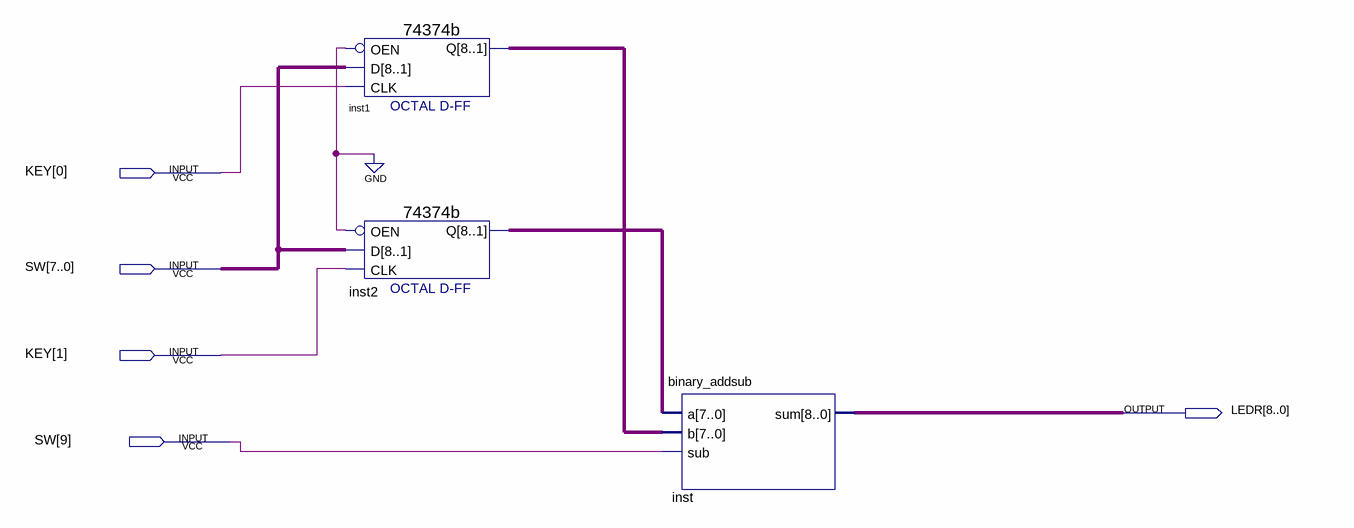
[diagram p0: schematic sheet]
// Quartus schematic binaryAddSub.bdf as structural Verilog: 3 symbols, 5 pins
module binaryAddSub (
  input  [1:0] KEY,
  input  [9:0] SW,
  output [8:0] LEDR
);

  wire [7:0] inst1_q, inst2_q;

  \74374b  inst1 (.D(SW[7:0]), .OEN(1'b0), .CLK(KEY[0]), .Q(inst1_q));
  \74374b  inst2 (.D(SW[7:0]), .OEN(1'b0), .CLK(KEY[1]), .Q(inst2_q));
  binary_addsub inst (.a(inst2_q), .b(inst1_q), .sub(SW[9]), .sum(LEDR));
endmodule
